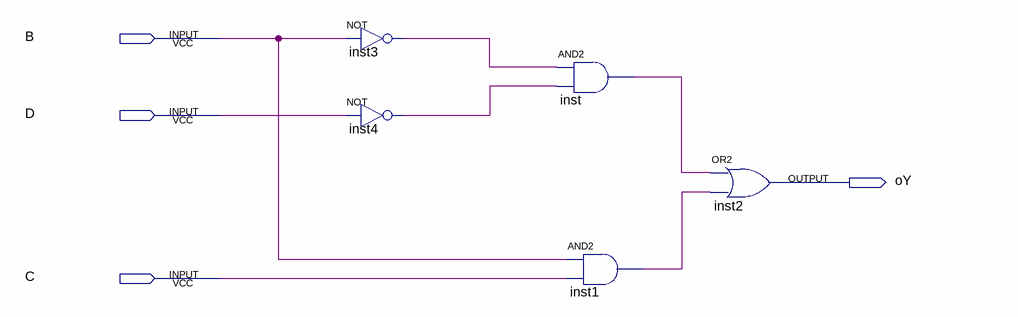
[diagram p0: schematic sheet]
// Quartus schematic Ejercicio9_Esquematico.bdf as structural Verilog: 5 symbols, 4 pins
module Ejercicio9_Esquematico (
  input  B,
  input  D,
  input  C,
  output oY
);

  wire inst1_out, inst3_out, inst4_out, inst_out;

  not inst3 (inst3_out, B);
  not inst4 (inst4_out, D);
  and inst (inst_out, inst3_out, inst4_out);
  and inst1 (inst1_out, B, C);
  or inst2 (oY, inst_out, inst1_out);
endmodule
